# EAGLE design 2NX_interleaved_boost_converter (EAGLE 9.2.2)

## Sheet 1 of 2
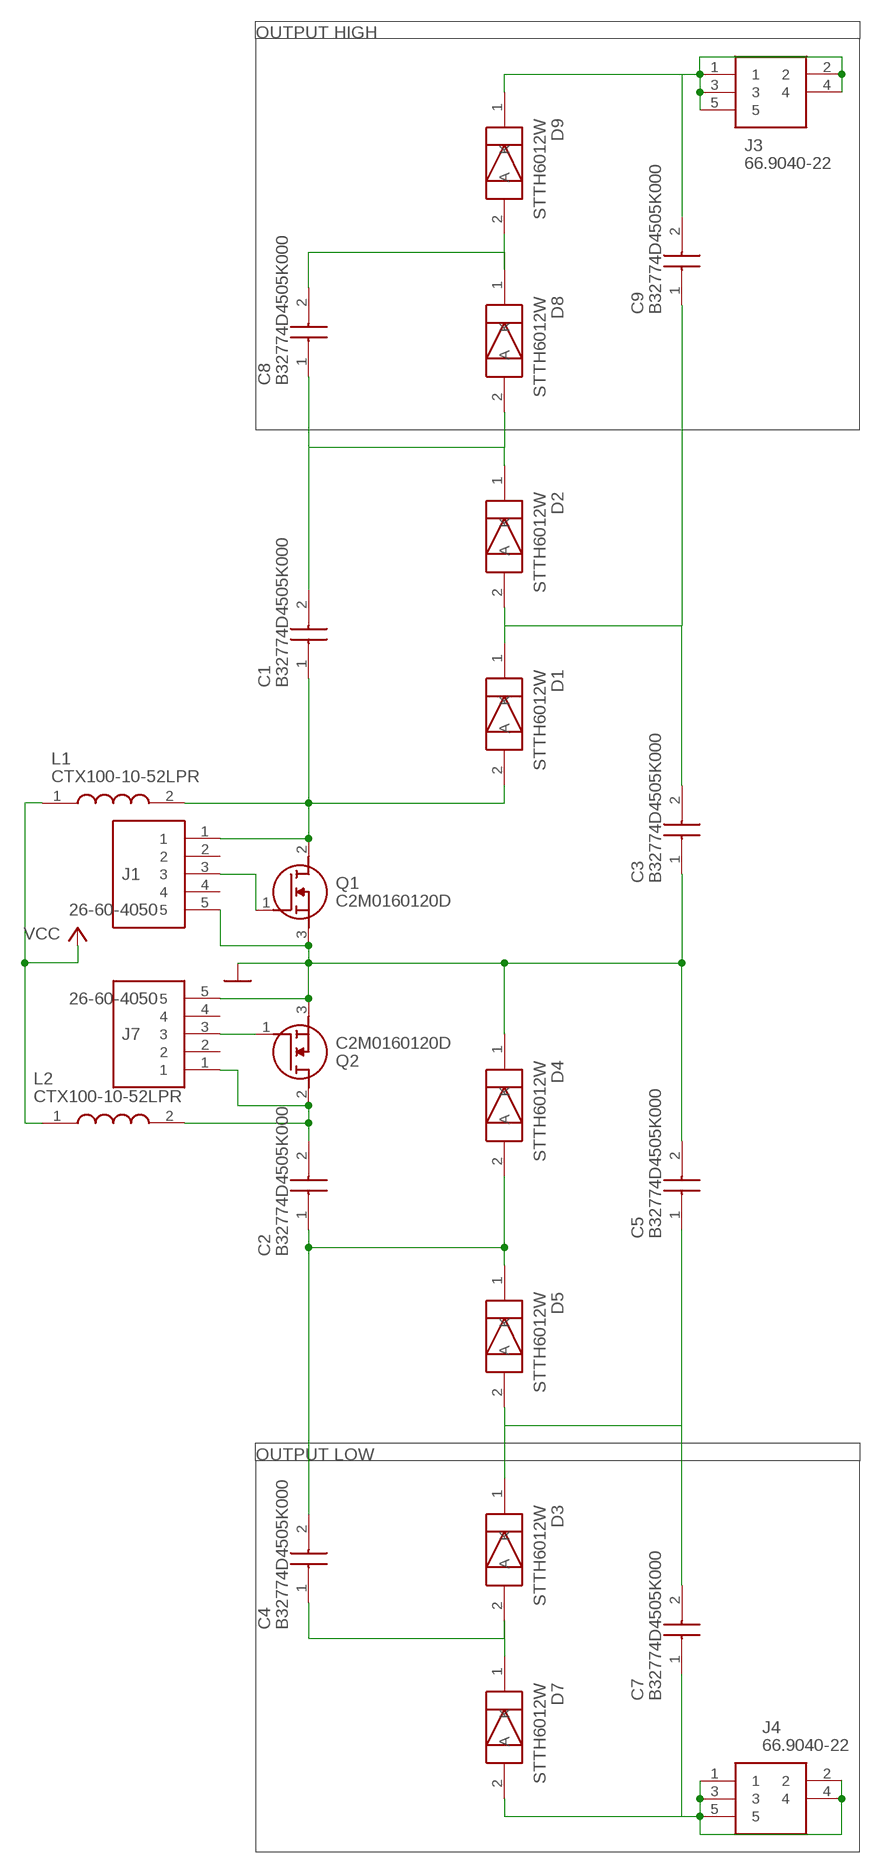
[diagram p0: schematic, sheet 1]

### Parts
C1  B32774D4505K000  [B32774D4505K000]
C2  B32774D4505K000  [B32774D4505K000]
C3  B32774D4505K000  [B32774D4505K000]
C4  B32774D4505K000  [B32774D4505K000]
C5  B32774D4505K000  [B32774D4505K000]
C7  B32774D4505K000  [B32774D4505K000]
C8  B32774D4505K000  [B32774D4505K000]
C9  B32774D4505K000  [B32774D4505K000]
D1  STTH6012W  [TO1090P515X1560X2445-2P]
D2  STTH6012W  [TO1090P515X1560X2445-2P]
D3  STTH6012W  [TO1090P515X1560X2445-2P]
D4  STTH6012W  [TO1090P515X1560X2445-2P]
D5  STTH6012W  [TO1090P515X1560X2445-2P]
D7  STTH6012W  [TO1090P515X1560X2445-2P]
D8  STTH6012W  [TO1090P515X1560X2445-2P]
D9  STTH6012W  [TO1090P515X1560X2445-2P]
J1  26-60-4050  [SHDR5W155P0X396_1X5_1966X1001X]
J3  66.9040-22  [66904022]
J4  66.9040-22  [66904022]
J7  26-60-4050  [SHDR5W155P0X396_1X5_1966X1001X]
L1  CTX100-10-52LPR  [CTX1001052LPR]
L2  CTX100-10-52LPR  [CTX1001052LPR]
Q1  C2M0160120D  [TO544P521X1594X2550-3P]
Q2  C2M0160120D  [TO544P521X1594X2550-3P]

### Nets
GND: C3.1 C5.2 D4.1(K) J1.5 J7.5 Q1.3(S) Q2.3(S) ; also sheet 2
N$1: C1.2 C8.1 D2.1(K) D8.2(A)
N$2: C1.1 D1.2(A) J1.1 L1.2 Q1.2(D)
N$3: C3.2 C9.1 D1.1(K) D2.2(A)
N$4: C8.2 D8.1(K) D9.2(A)
N$5: C2.2 J7.1 L2.2 Q2.2(D)
N$6: C9.2 D9.1(K) J3.1 J3.2 J3.3 J3.4 J3.5
N$7: C4.1 D3.2(A) D7.1(K)
N$8: C2.1 C4.2 D4.2(A) D5.1(K)
N$9: C5.1 C7.2 D3.1(K) D5.2(A)
N$10: C7.1 D7.2(A) J4.1 J4.2 J4.3 J4.4 J4.5
N$12: J1.3 Q1.1(G)
N$13: J7.3 Q2.1(G)
VCC: L1.1 L2.1 ; also sheet 2
Unconnected: J1.2 J1.4 J7.2 J7.4

### Notes on the sheet
- OUTPUT HIGH
- OUTPUT LOW

## Sheet 2 of 2
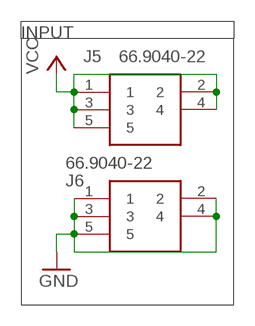
[diagram p1: schematic, sheet 2]

### Parts
J5  66.9040-22  [66904022]
J6  66.9040-22  [66904022]

### Nets
GND: J6.1 J6.2 J6.3 J6.4 J6.5 ; also sheet 1
VCC: J5.1 J5.2 J5.3 J5.4 J5.5 ; also sheet 1

### Notes on the sheet
- INPUT

## Library data of the parts
C1-C5 C7-C9 = SamacSys_Parts:B32774D4505K000: Epcos B32774D 5F Polypropylene Film Capacitor 450 V dc 10% Source: Datasheet <https://en.tdk-electronics.tdk.com/inf/20/20/db/fc_2009/MKP_B32774_778.pdf>; ARROW_PART_NUMBER: B32774D4505K000; ARROW_PRICE-STOCK: https://www.arrow.com/en/products/b32774d4505k000/epcos-tdk; DESCRIPTION: Epcos B32774D 5F Polypropylene Film Capacitor 450 V dc 10%; HEIGHT: 21mm; MANUFACTURER_NAME: EPCOS; MANUFACTURER_PART_NUMBER: B32774D4505K000; RS_PART_NUMBER: 1726009; RS_PRICE-STOCK: http://uk.rs-online.com/web/p/products/1726009
D1-D5 D7-D9 = SamacSys_Parts:STTH6012W: STTH6012W, Fast Recovery Rectifier Diode, Switching 60A max, 1200V 125ns, 2-Pin, DO-247 Source: Datasheet <http://www.st.com/web/en/resource/technical/document/datasheet/CD00096472.pdf>; ALLIED_NUMBER: 70014108; ALLIED_PRICE-STOCK: http://www.alliedelec.com/stmicroelectronics-stth6012w/70014108/; ARROW_PART_NUMBER: STTH6012W; ARROW_PRICE-STOCK: https://www.arrow.com/en/products/stth6012w/stmicroelectronics; DESCRIPTION: STTH6012W, Fast Recovery Rectifier Diode, Switching 60A max, 1200V 125ns, 2-Pin, DO-247; HEIGHT: 5.15mm; MANUFACTURER_NAME: STMicroelectronics; MANUFACTURER_PART_NUMBER: STTH6012W; RS_PART_NUMBER: 6870818; RS_PRICE-STOCK: http://uk.rs-online.com/web/p/rectifier-schottky-diodes/6870818/?source=DS
J1 J7 = SamacSys_Parts:26-60-4050: Molex KK 396 Series, Series Number 41791, 3.96mm Pitch 5 Way 1 Row Straight PCB Header, Solder Termination, 7A Source: Datasheet <https://componentsearchengine.com/Datasheets/1/26-60-4050.pdf>; DESCRIPTION: Molex KK 396 Series, Series Number 41791, 3.96mm Pitch 5 Way 1 Row Straight PCB Header, Solder Termination, 7A; HEIGHT: 14.78mm; MANUFACTURER_NAME: Molex; MANUFACTURER_PART_NUMBER: 26-60-4050; MOUSER_PART_NUMBER: 538-26-60-4050
J3-J6 = SamacSys_Parts:66.9040-22: STAUBLI - 66.9040-22 - SOCKET, PCB, 4MM, R/A, RED Source: Datasheet <http://www.farnell.com/datasheets/1479998.pdf>; ALLIED_NUMBER: 70749834; ALLIED_PRICE-STOCK: https://www.alliedelec.com/staubli-66-9040-22/70749834/; ARROW_PART_NUMBER: 66.9040-22; DESCRIPTION: STAUBLI - 66.9040-22 - SOCKET, PCB, 4MM, R/A, RED; HEIGHT: 11mm; MANUFACTURER_NAME: STAUBLI; MANUFACTURER_PART_NUMBER: 66.9040-22
L1 L2 = SamacSys_Parts:CTX100-10-52LPR: Fixed Inductors 100uH 13A Source: Datasheet <http://www.cooperindustries.com/content/dam/public/bussmann/Electronics/Resources/product-datasheets/Bus_Elx_DS_PM 4304_LPCI_Series.pdf>; ARROW_PART_NUMBER: CTX100-10-52LPR; DESCRIPTION: Fixed Inductors 100uH 13A; HEIGHT: 27.5mm; MANUFACTURER_NAME: Eaton; MANUFACTURER_PART_NUMBER: CTX100-10-52LPR
Q1 = SamacSys_Parts:C2M0160120D: Wolfspeed C2M0160120D N-channel SiC MOSFET Transistor, 19 A, 1200 V, 3-Pin TO-247 Source: Datasheet <http://www.wolfspeed.com/media/downloads/169/C2M0160120D.pdf>; ARROW_PART_NUMBER: C2M0160120D; ARROW_PRICE-STOCK: http://uk.rs-online.com/web/p/products/1629709; DESCRIPTION: Wolfspeed C2M0160120D N-channel SiC MOSFET Transistor, 19 A, 1200 V, 3-Pin TO-247; HEIGHT: 5.21mm; MANUFACTURER_NAME: Wolfspeed; MANUFACTURER_PART_NUMBER: C2M0160120D; RS_PART_NUMBER: 1629709; RS_PRICE-STOCK: http://uk.rs-online.com/web/p/products/1629709
Q2 = SamacSys_Parts:C2M0160120D: Wolfspeed C2M0160120D N-channel SiC MOSFET Transistor, 19 A, 1200 V, 3-Pin TO-247 Source: Datasheet <http://www.wolfspeed.com/media/downloads/169/C2M0160120D.pdf>; ARROW_PART_NUMBER: C2M0160120D; ARROW_PRICE-STOCK: http://uk.rs-online.com/web/p/products/1629709; DESCRIPTION: Wolfspeed C2M0160120D N-channel SiC MOSFET Transistor, 19 A, 1200 V, 3-Pin TO-247; HEIGHT: 5.21mm; MANUFACTURER_NAME: Wolfspeed; MANUFACTURER_PART_NUMBER: C2M0160120D; RS_PART_NUMBER: 1629709; RS_PRICE-STOCK: http://uk.rs-online.com/web/p/products/1629709; SPICEPREFIX: Q

## Board
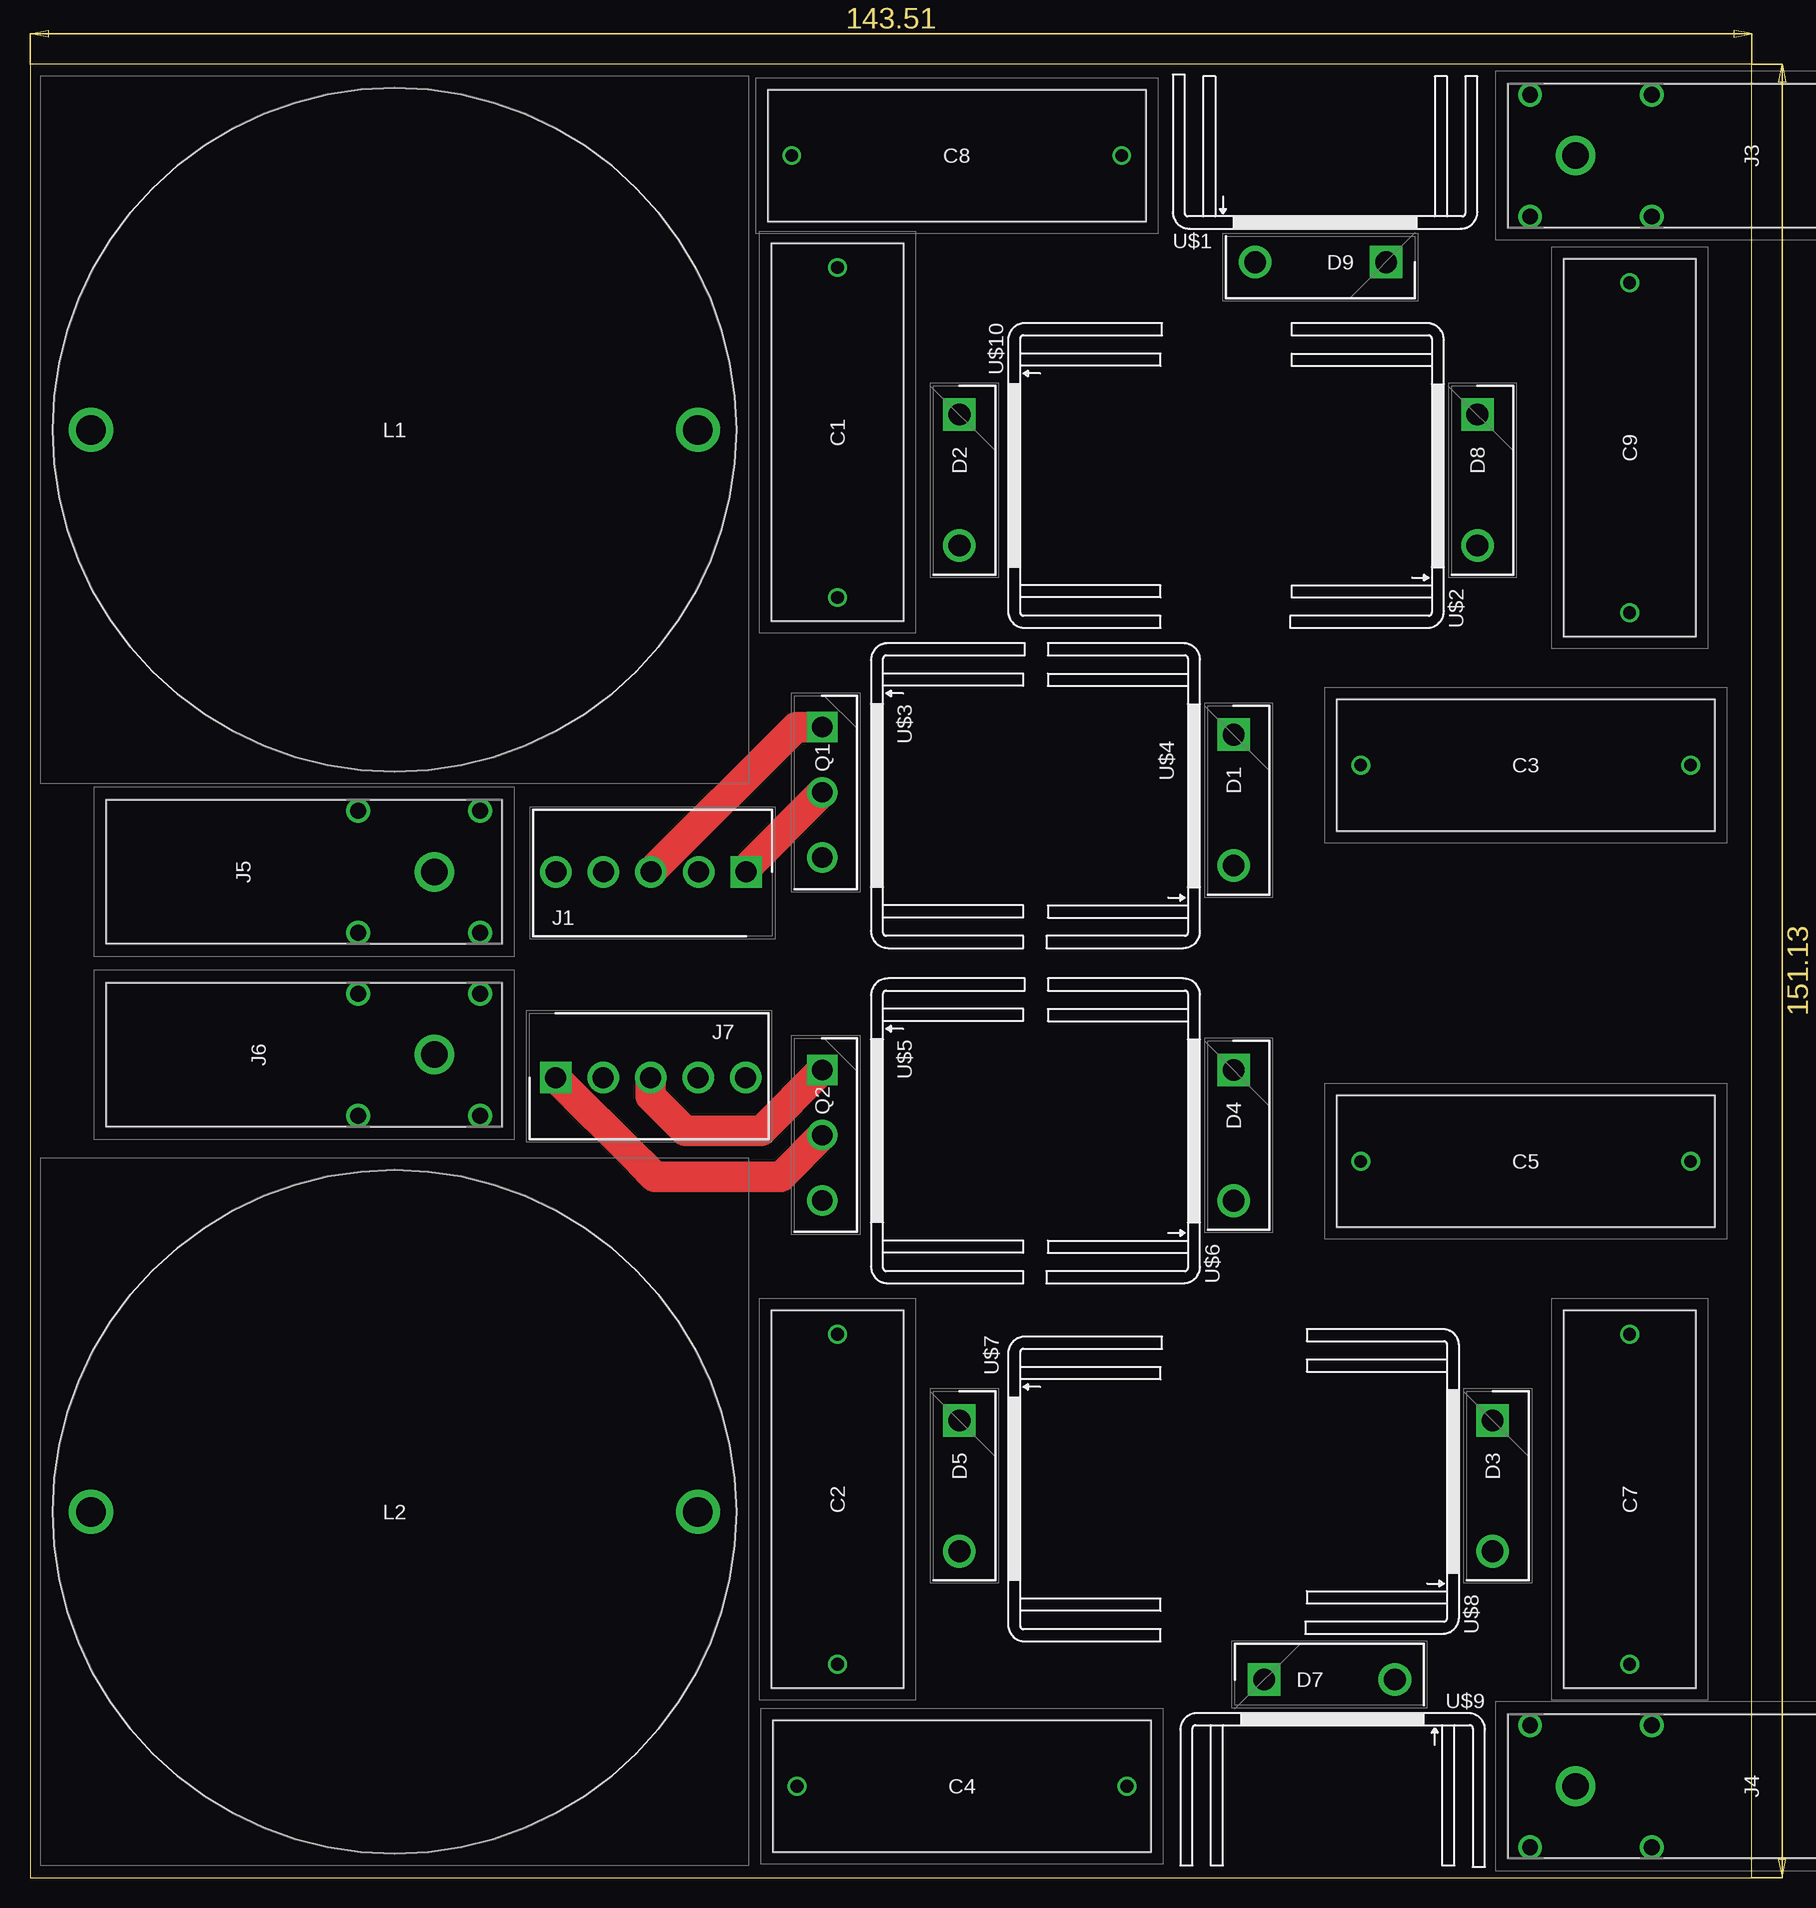
[diagram p2: board, top side]
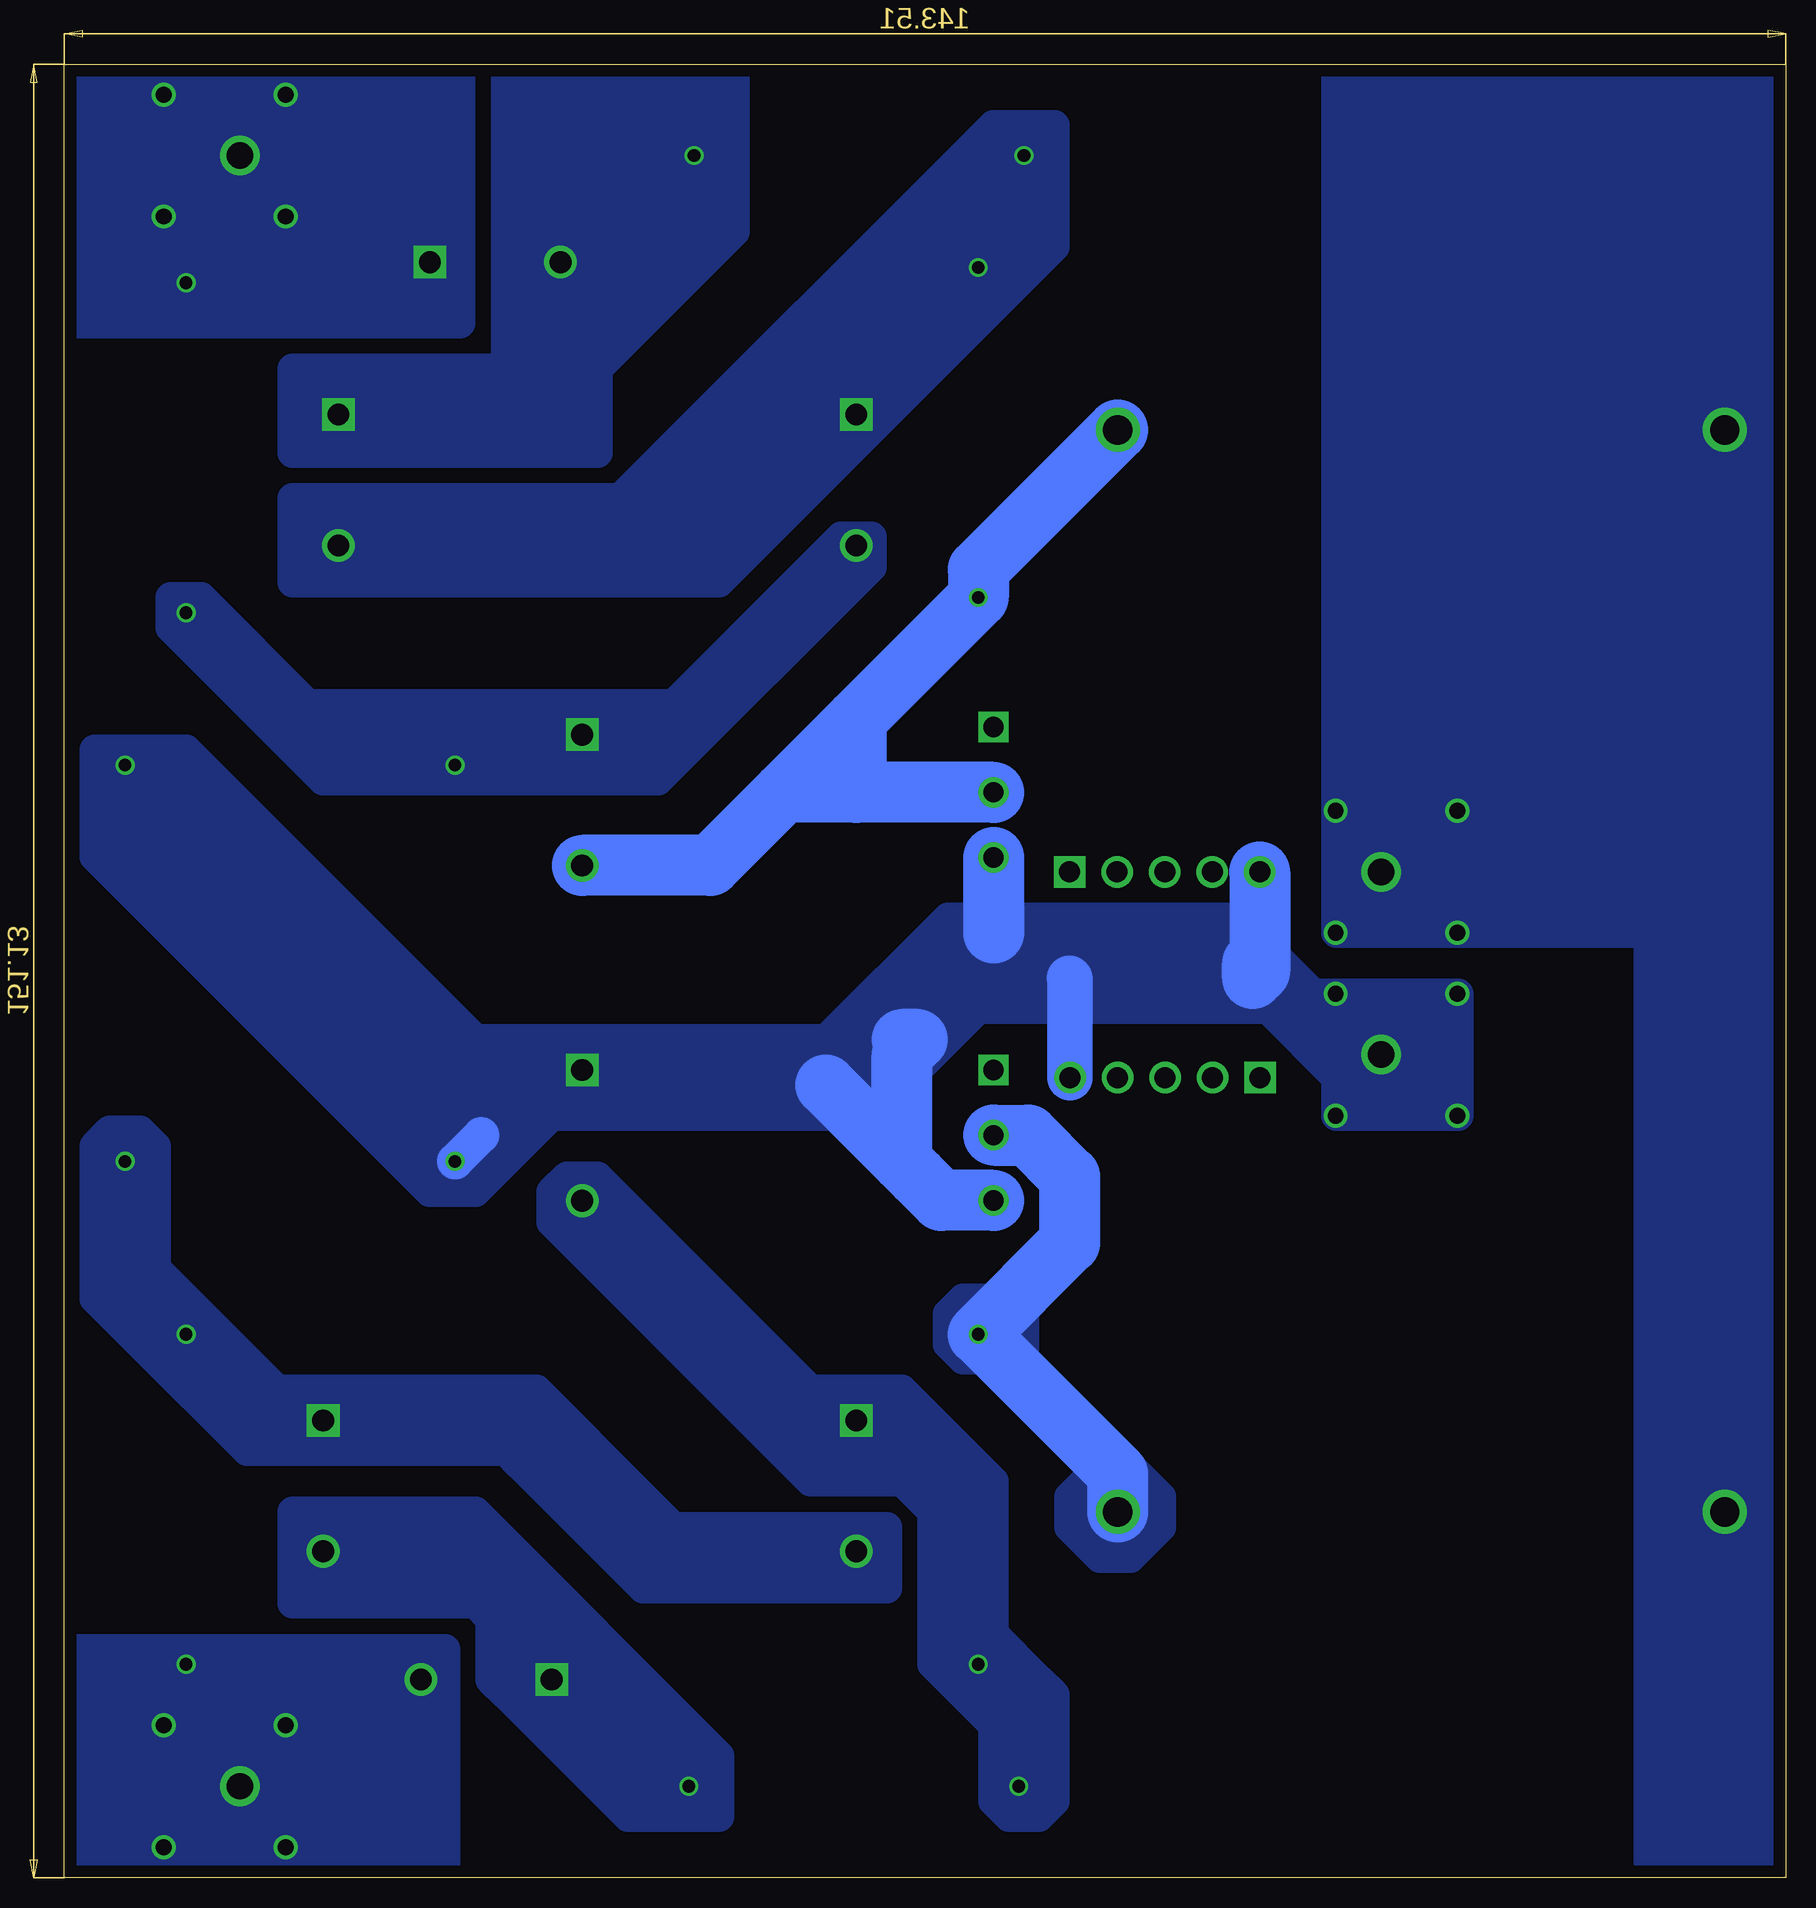
[diagram p3: board, bottom side, seen from below]

Size 143.51 x 151.13 mm. Coordinates in mm from the lower left corner, seen from the top.
Outline: 0,0 143.51,0 143.51,151.13 0,151.13 0,0
Copper layers (1*16): Top 0.035mm / dielectric 1.5mm / Bottom 0.035mm
Design rules "default": minimum track width 6mil, minimum drill 0.35mm, track to track 6mil, track to pad 6mil, pad to pad 6mil, via to via 6mil, smd to smd 6mil, copper to edge 40mil, drill to drill 6mil, minimum pad ring 10mil, minimum via ring 8mil, stop-mask expansion 4mil, vias tented up to drill 0mil, thermal gap 10mil

### Footprints (pad centres in the part's own frame; a part is rotated, then mirrored left to right if it is on the bottom)
B32774D4505K000 = drill 1.05 pad 1.575: 1 0,0; 2 27.5,0
TO1090P515X1560X2445-2P = drill 1.81 pad 2.715 square: 1 0,0 | drill 1.81 pad 2.715: 2 10.9,0
SHDR5W155P0X396_1X5_1966X1001X = drill 1.75 pad 2.625 square: 1 0,0 | drill 1.75 pad 2.625: 2 -3.96,0; 3 -7.92,0; 4 -11.88,0; 5 -15.84,0
66904022 = drill 1.33 pad 1.995: 1 -5.08,-14.66; 2 5.08,-14.66; 3 5.08,-4.5; 4 -5.08,-4.5 | drill 2.2 pad 3.3: 5 0,-10.86
CTX1001052LPR = drill 2.45 pad 3.675: 1 0,0; 2 50.6,0
TO544P521X1594X2550-3P = drill 1.69 pad 2.535 square: 1 0,0 | drill 1.69 pad 2.535: 2 5.44,0; 3 10.88,0

### Placement (x,y rotation side)
C1  67.31,106.68 90 top
C2  67.31,17.78 90 top
C3  138.43,92.71 180 top
C4  91.44,7.62 180 top
C5  138.43,59.69 180 top
C7  133.35,17.78 90 top
C8  63.5,143.51 0 top
C9  133.35,105.41 90 top
D1  100.33,95.25 270 top
D2  77.47,121.92 270 top
D3  121.92,38.1 270 top
D4  100.33,67.31 270 top
D5  77.47,38.1 270 top
D7  102.87,16.51 0 top
D8  120.65,121.92 270 top
D9  113.03,134.62 180 top
J1  59.69,83.82 0 top
J3  139.7,143.51 270 top
J4  139.7,7.62 270 top
J5  22.86,83.82 90 top
J6  22.86,68.58 90 top
J7  43.81,66.67 180 top
L1  5.08,120.65 0 top
L2  5.08,30.48 0 top
Q1  66.04,95.89 270 top
Q2  66.04,67.31 270 top
U$1  [FK213]  107.95,138.43 0 top
U$2  [FK213]  116.84,116.84 90 top
U$3  [FK213]  71.12,90.17 270 top
U$4  [FK213]  96.52,90.17 90 top
U$5  [FK213]  71.12,62.23 270 top
U$6  [FK213]  96.52,62.23 90 top
U$7  [FK213]  82.55,32.38 270 top
U$8  [FK213]  118.11,33.02 90 top
U$9  [FK213]  108.58,12.7 180 top
U$10  [FK213]  82.55,116.84 270 top

### Tracks (layer width: path | path; a pad name or v marks a point on that pad's centre or on a via)
GND
  Bottom 3.048: 108.75,61.87 C5.2
  Bottom 3.81: J7.5 59.66,74.89 59.69,74.93
  Bottom 5.08: J1.5 43.85,75.53 44.45,74.93 44.45,76.2 | Q1.3 66.04,78.74 | Q2.3 70.4,56.43 72.39,58.42 73.66,59.69 | 73.66,59.69 80.01,66.04 | 73.66,59.69 73.66,68.58 72.39,69.85 73.66,69.85
  pour Bottom (no thermals): 27.3,63.5 37.47,63.5 37.47,66.67 43.18,72.39 67.31,72.39 76.2,63.5 102.87,63.5 109.22,57.15 113.03,57.15 140.97,85.09 140.97,93.98 133.35,93.98 109.22,69.85 80.01,69.85 69.85,80.01 45.72,80.01 39.37,73.66 27.3,73.66
N$1
  pour Bottom (no thermals): 124.46,114.94 97.16,114.94 66.04,146.05 60.96,146.05 60.96,135.89 88.9,107.95 124.46,107.95
N$2
  Top 2.54: J1.1 59.69,84.09 Q1.2
  Bottom 5.08: L1.2 67.31,109.02 C1.1 77.47,96.52 | 77.47,96.52 83.55,90.44 | D1.2 89.64,84.35 83.55,90.44 | 83.55,90.44 Q1.2 77.47,90.44 77.47,96.52
N$3
  pour Bottom (no thermals): 76.2,111.76 78.74,111.76 92.71,97.79 123.19,97.79 132.08,106.68 134.62,106.68 134.62,104.14 121.92,91.44 93.98,91.44 76.2,109.22
N$4
  pour Bottom (no thermals): 99.06,118.75 124.46,118.75 124.46,125.73 106.68,125.73 106.68,149.86 87.63,149.86 87.63,137.16 99.06,125.73
N$5
  Top 2.54: J7.1 50.8,59.69 | 50.8,59.69 52.07,58.42 62.59,58.42 Q2.2 | 50.8,59.69
  Bottom 5.08: L2.2 55.68,33.65 C2.2 59.69,52.9 59.69,58.42 63.14,61.87 Q2.2
  pour Bottom (no thermals): 52.07,31.75 52.07,29.21 54.61,26.67 57.15,26.67 59.69,29.21 59.69,31.75 57.15,34.29 54.61,34.29
  pour Bottom (no thermals): 64.77,48.26 68.58,48.26 69.85,46.99 69.85,44.45 68.58,43.18 63.5,43.18 63.5,46.99
N$6
  pour Bottom (no thermals): 142.24,149.86 110.49,149.86 110.49,134.62 110.49,129.54 142.24,129.54
N$7
  pour Bottom (no thermals): 124.46,30.48 109.22,30.48 88.9,10.16 88.9,5.08 96.52,5.08 106.68,15.24 107.95,16.51 107.95,21.59 109.22,22.86 120.65,22.86 124.46,22.86
N$8
  pour Bottom (no thermals): 63.5,5.08 64.77,5.08 66.04,6.35 66.04,12.7 71.12,17.78 71.12,30.48 73.66,33.02 81.28,33.02 102.87,54.61 102.87,57.15 101.6,58.42 99.06,58.42 81.28,40.64 73.66,40.64 72.39,39.37 66.04,33.02 66.04,24.13 66.04,20.32 62.23,16.51 60.96,15.24 60.96,12.7 60.96,6.35 62.23,5.08
N$9
  pour Bottom (no thermals): 74.93,29.21 74.93,24.13 80.01,24.13 95.25,24.13 105.41,34.29 106.68,35.56 128.27,35.56 137.16,44.45 140.97,48.26 140.97,60.96 139.7,62.23 137.16,62.23 135.89,60.96 135.89,50.8 125.73,40.64 123.19,40.64 104.14,40.64 95.25,31.75 92.71,29.21
N$10
  pour Bottom (no thermals): 142.24,1.27 142.24,19.05 111.76,19.05 111.76,1.27
N$12
  Top 2.54: J1.3 63.84,95.89 Q1.1
N$13
  Top 2.54: Q2.1 60.96,62.23 54.61,62.23 51.73,65.11 J7.3
VCC
  pour Bottom (no thermals): 37.47,78.74 37.47,149.86 1.27,149.86 1.27,1.27 11.43,1.27 11.43,78.74